# Altium project DC_Main_sample_A.PrjPcb (part 1 of 2)
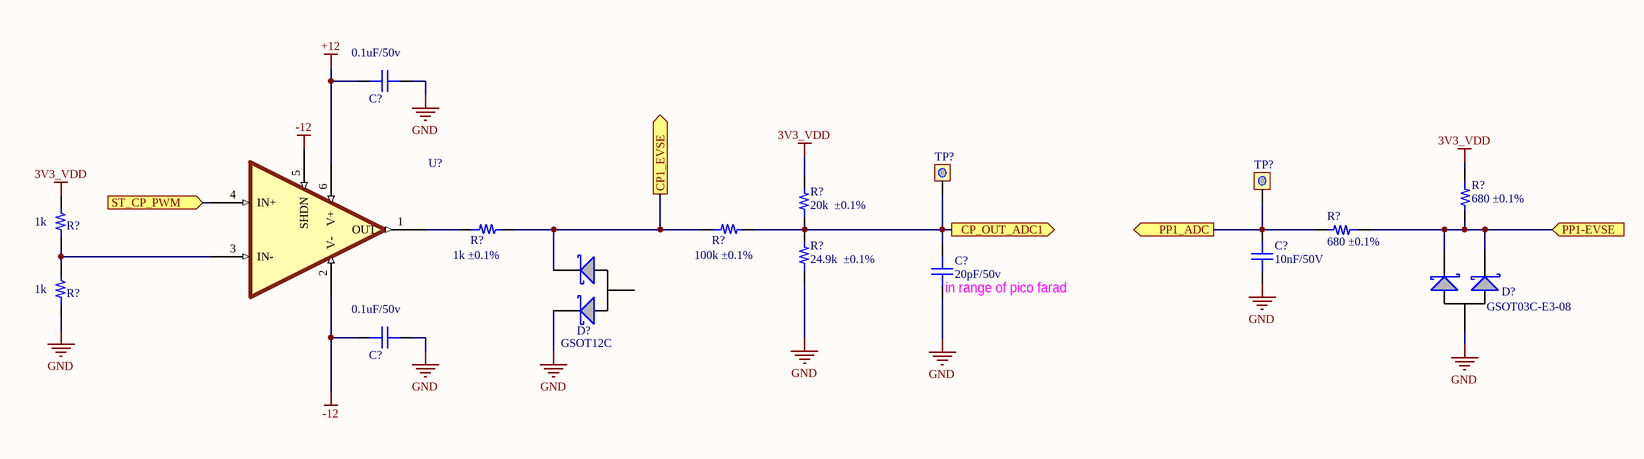
[diagram p0: Control_Pilot.SchDoc]
8 sheets, 353 parts. Net scope: flat (ports and power ports of the same name join across sheets).
Sheets:
  Control_Pilot.SchDoc
  PLC.SchDoc
  Analog_Interface.SchDoc
  Memory.SchDoc
  Power_Supply.SchDoc
  Screen_Interface.SchDoc
  CAN_Interface.SchDoc
  STM32.SchDoc

## Sheet Control_Pilot.SchDoc
size B; SheetNumber: 1; SheetTotal: 8

### Parts
(Parts that share a designator on the sheet are numbered #1, #2 ... from top to bottom, then left to right.)
C?#1  value 0.1uF/50v  [C1206]  (hidden comment: Capacitor)
C?#2  value 10nF/50V  [C1206]  (hidden comment: Capacitor)
C?#3  value 20pF/50v  [C1206]  (hidden comment: Capacitor)
C?#4  value 0.1uF/50v  [C1206]  (hidden comment: Capacitor)
D?#1  value GSOT12C  (hidden comment: GSOT12C-E3-08)
D?#2  GSOT03C-E3-08
R?#1  value 680 ±0.1%  [R0603]  (hidden comment: Resistor)
R?#2  value 1k ±0.1%  [R0603]  (hidden comment: Resistor)
R?#3  value 100k ±0.1%  [R0603]  (hidden comment: Resistor)
R?#4  value 20k  ±0.1%  [R0603]  (hidden comment: Resistor)
R?#5  value 680 ±0.1%  [R0603]  (hidden comment: Resistor)
R?#6  value 1k  [R0402]  (hidden comment: Resistor)
R?#7  value 24.9k  ±0.1%  [R0603]  (hidden comment: Resistor)
R?#8  value 1k  [R0402]  (hidden comment: Resistor)
TP?#1  TEST-PIN  [Test_Pin]  (value not drawn)  (no BOM)
TP?#2  TEST-PIN  [Test_Pin]  (value not drawn)  (no BOM)
U?#1  Comparator  [SOT-23-6]  (value not drawn)

### Ports
CP1_EVSE (out), CP_OUT_ADC1 (out), PP1-EVSE (in), PP1_ADC (out), ST_CP_PWM (in)

### Nets
3V3_VDD: R?#1.1 R?#4.1 R?#6.1  [project net 3V3_CG]
+12: C?#1.1 U?#1.6(V+)
-12: C?#4.1 U?#1.2(V-) U?#1.5(SHDN)
GND: C?#1.1 C?#2.1 C?#3.1 C?#4.1 D?#1.1(K1) D?#2.3(A) R?#7.1 R?#8.1
NetC?#2_1: C?#2.1 R?#5.1 TP?#2.1(TP) ; port PP1_ADC
NetC?#3_1: C?#3.1 R?#3.1 R?#4.1 R?#7.1 TP?#1.1(TP) ; port CP_OUT_ADC1
NetD?#1_2: D?#1.2(K2) R?#2.1 R?#3.1 ; port CP1_EVSE
NetD?#2_1: D?#2.1(K1) D?#2.2(K2) R?#1.1 R?#5.1 ; port PP1-EVSE
NetR?#2_1: R?#2.1 U?#1.1(OUT)
NetR?#6_1: R?#6.1 R?#8.1 U?#1.3(IN-)
NetU?#1_4: U?#1.4(IN+) ; port ST_CP_PWM

Not connected (* = marked no-connect by the designer): D?#1 3(A)

### Notes on the sheet
- (near C?#3) in range of pico farad

### Library data of the parts
C?#1-C?#4 = CAP_SMT: ComponentLink1Description: New link
D?#1 D?#2 = GSOT03C-E3-08: 12.3V Clamp 30A (8/20µs) Ipp Tvs Diode Surface Mount SOT-23-3; ComponentLink1Description: New link
  D?#2: value: GSOT03C-E3-08
R?#1-R?#8 = RES_SMT: ComponentLink1Description: New link; ComponentLink1URL: *
U?#1 = TLV1805QDBVRQ1: Automotive high volt comparator with push-pull output and shutdown 6-SOT-23 -40 to 125; ComponentLink1Description: New link; ComponentLink1URL: *
TP?#1 TP?#2 = TEST-PIN: ComponentLink1Description: Link

## Sheet PLC.SchDoc
size C; SheetNumber: 2; SheetTotal: 8
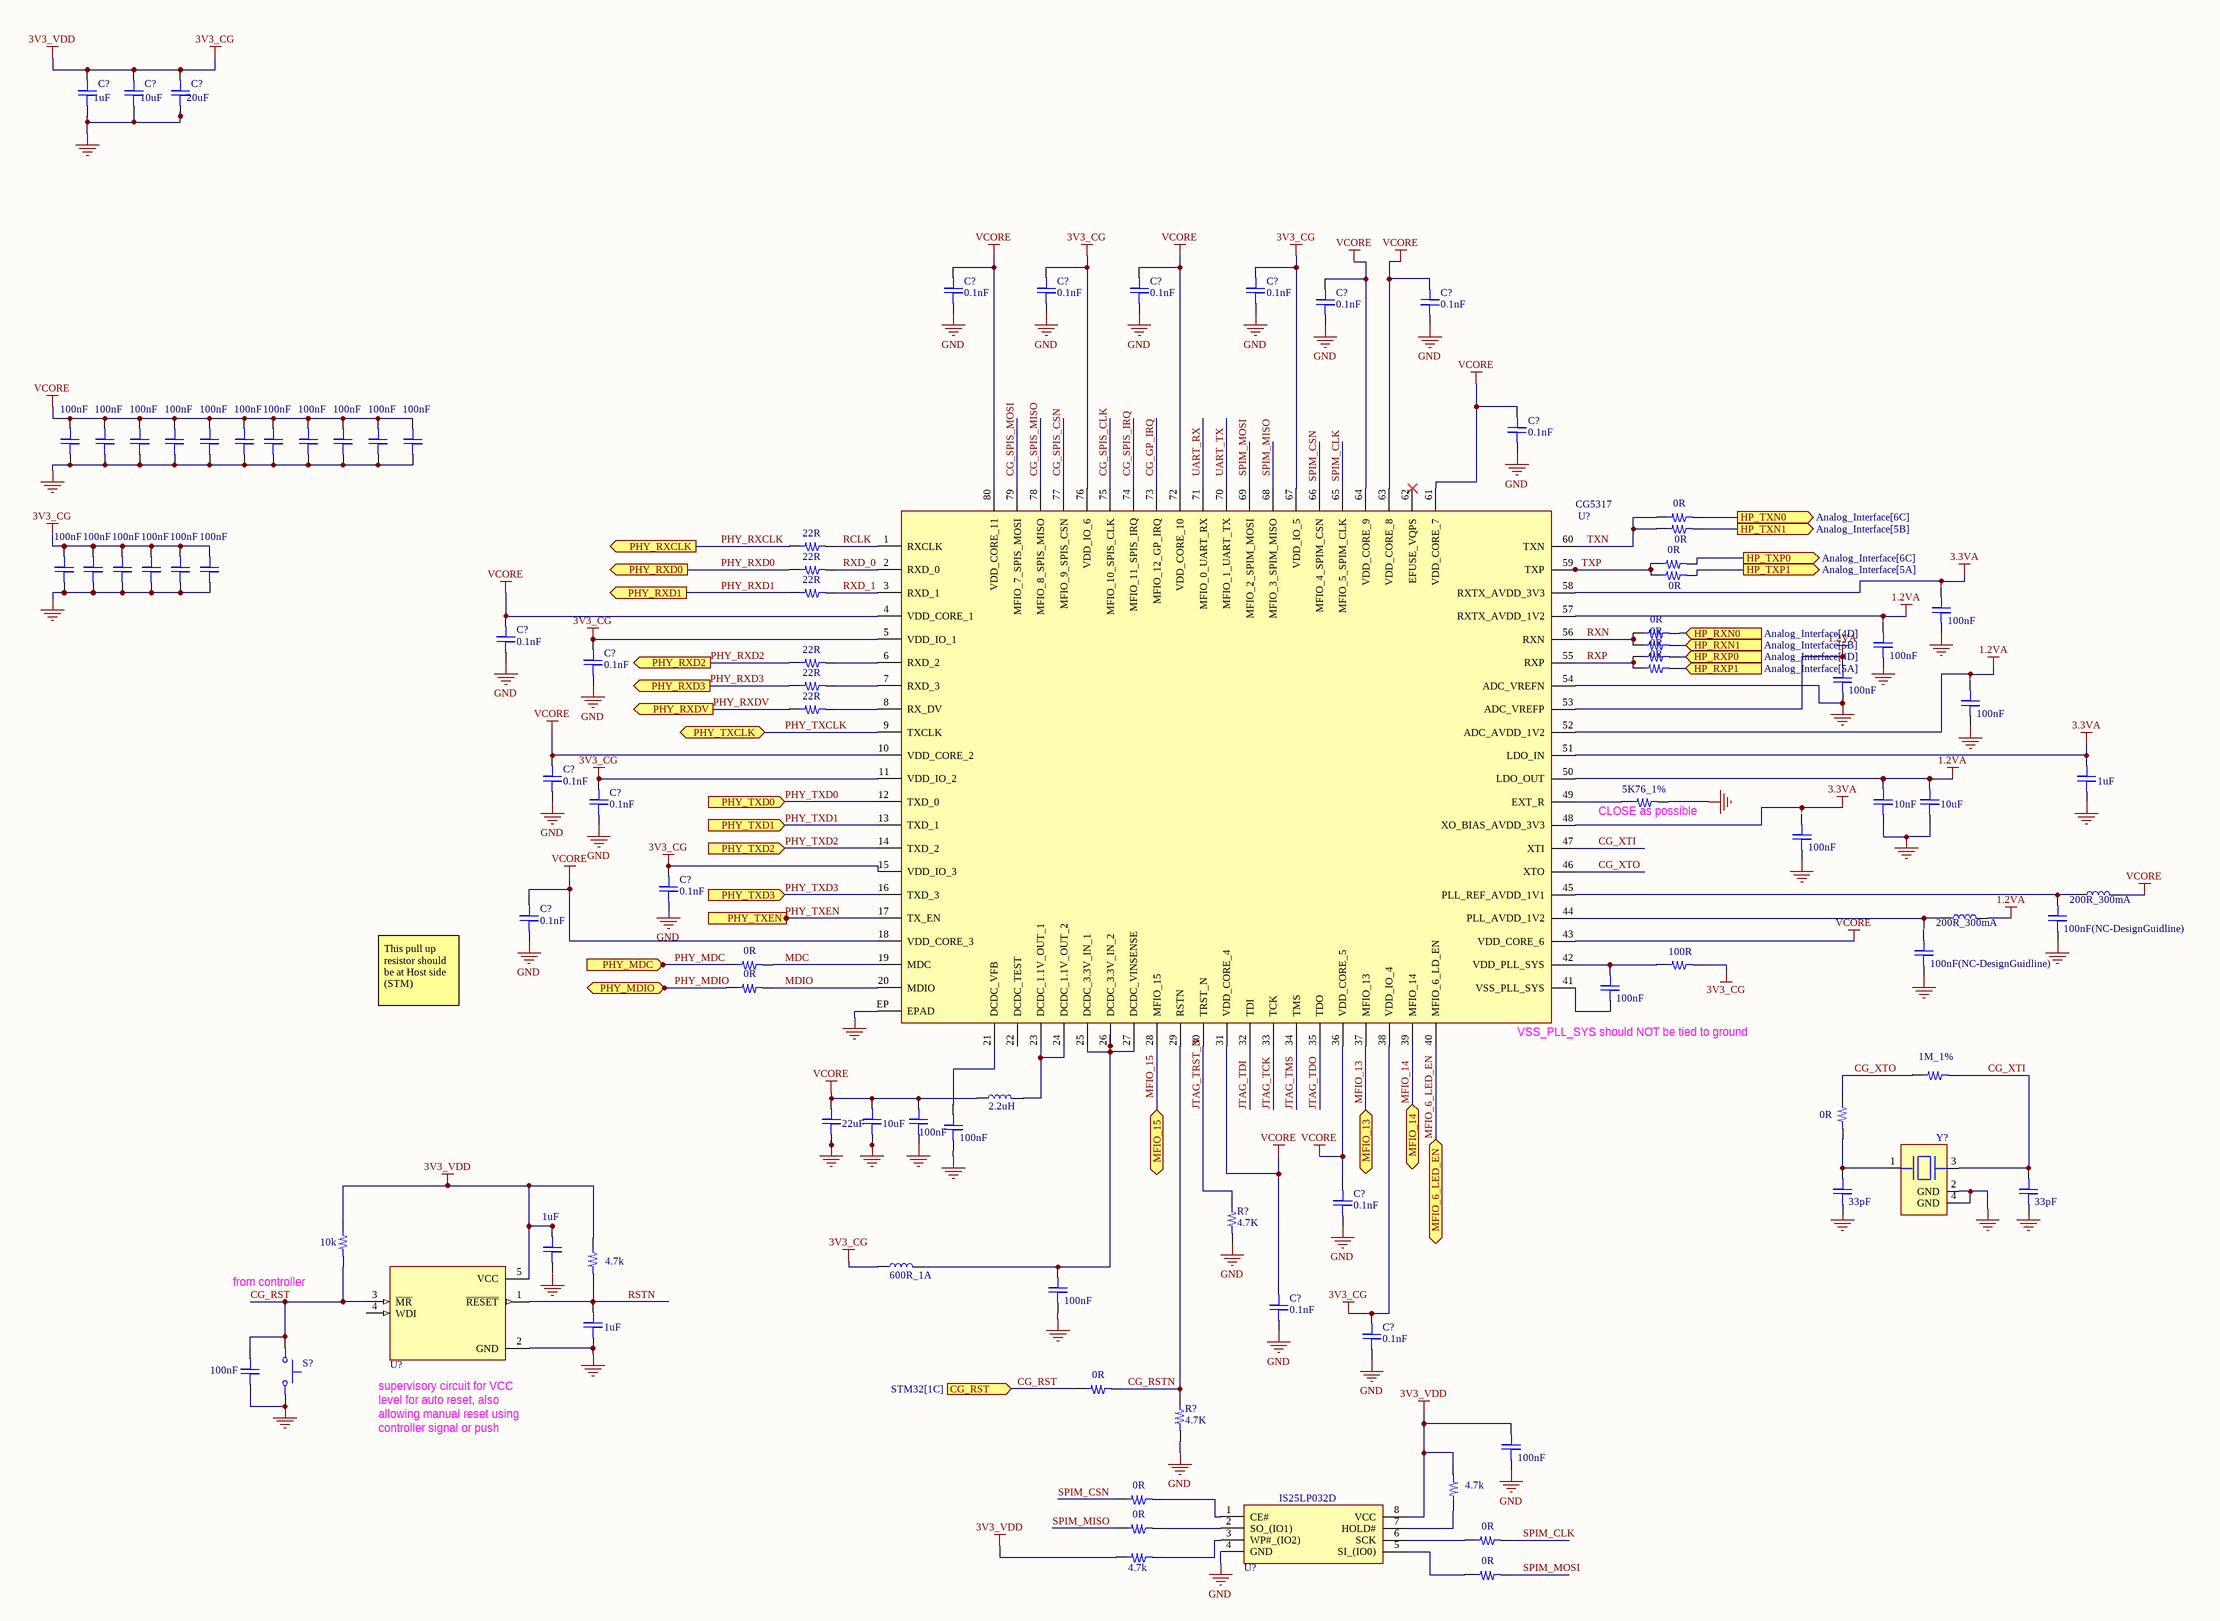
[diagram p1: PLC.SchDoc]

### Parts
(Parts that share a designator on the sheet are numbered #1, #2 ... from top to bottom, then left to right.)
C?#5  value 1uF  [C0402]
C?#6  value 10uF  [C0402]
C?#7  value 20uF  [C0402]
C?#8  value 0.1nF  [C0402]  (hidden comment: Capacitor)
C?#9  value 0.1nF  [C0402]  (hidden comment: Capacitor)
C?#10  value 0.1nF  [C0402]  (hidden comment: Capacitor)
C?#11  value 0.1nF  [C0402]  (hidden comment: Capacitor)
C?#12  value 0.1nF  [C0402]  (hidden comment: Capacitor)
C?#13  value 0.1nF  [C0402]  (hidden comment: Capacitor)
C?#14  value 0.1nF  [C0402]  (hidden comment: Capacitor)
C?#15  value 100nF  [C0402]  (hidden comment: Capacitor)
C?#16  value 100nF  [C0402]  (hidden comment: Capacitor)
C?#17  value 100nF  [C0402]  (hidden comment: Capacitor)
C?#18  value 100nF  [C0402]  (hidden comment: Capacitor)
C?#19  value 100nF  [C0402]  (hidden comment: Capacitor)
C?#20  value 100nF  [C0402]  (hidden comment: Capacitor)
C?#21  value 100nF  [C0402]  (hidden comment: Capacitor)
C?#22  value 100nF  [C0402]  (hidden comment: Capacitor)
C?#23  value 100nF  [C0402]  (hidden comment: Capacitor)
C?#24  value 100nF  [C0402]  (hidden comment: Capacitor)
C?#25  value 100nF  [C0402]  (hidden comment: Capacitor)
C?#26  value 100nF  [C0402]  (hidden comment: Capacitor)
C?#27  value 100nF  [C0402]  (hidden comment: Capacitor)
C?#28  value 100nF  [C0402]  (hidden comment: Capacitor)
C?#29  value 100nF  [C0402]  (hidden comment: Capacitor)
C?#30  value 100nF  [C0402]  (hidden comment: Capacitor)
C?#31  value 100nF  [C0402]  (hidden comment: Capacitor)
C?#32  value 100nF  [C0402]  (hidden comment: Capacitor)
C?#33  value 100nF  [C0402]  (hidden comment: Capacitor)
C?#34  value 0.1nF  [C0402]  (hidden comment: Capacitor)
C?#35  value 100nF  [C0402]  (hidden comment: Capacitor)
C?#36  value 0.1nF  [C0402]  (hidden comment: Capacitor)
C?#37  value 100nF  [C0402]  (hidden comment: Capacitor)
C?#38  value 1uF  [C0402]  (hidden comment: Capacitor)
C?#39  value 0.1nF  [C0402]  (hidden comment: Capacitor)
C?#40  value 10nF  [C0402]  (hidden comment: Capacitor)
C?#41  value 10uF  [C0402]  (hidden comment: Capacitor)
C?#42  value 0.1nF  [C0402]  (hidden comment: Capacitor)
C?#43  value 100nF  [C0402]  (hidden comment: Capacitor)
C?#44  value 0.1nF  [C0402]  (hidden comment: Capacitor)
C?#45  value 100nF(NC-DesignGuidline)  [C0402]  (hidden comment: Capacitor)
C?#46  value 0.1nF  [C0402]  (hidden comment: Capacitor)
C?#47  value 100nF(NC-DesignGuidline)  [C0402]  (hidden comment: Capacitor)
C?#48  value 100nF  [C0402]  (hidden comment: Capacitor)
C?#49  value 22uF  [C0402]  (hidden comment: Capacitor)
C?#50  value 10uF  [C0402]  (hidden comment: Capacitor)
C?#51  value 100nF  [C0402]  (hidden comment: Capacitor)
C?#52  value 100nF  [C0402]  (hidden comment: Capacitor)
C?#53  value 33pF  [C0402]  (hidden comment: Capacitor)
C?#54  value 33pF  [C0402]  (hidden comment: Capacitor)
C?#55  value 0.1nF  [C0402]  (hidden comment: Capacitor)
C?#56  value 1uF  [C0402]  (hidden comment: Capacitor)
C?#57  value 0.1nF  [C0402]  (hidden comment: Capacitor)
C?#58  value 100nF  [C0402]  (hidden comment: Capacitor)
C?#59  value 0.1nF  [C0402]  (hidden comment: Capacitor)
C?#60  value 1uF  [C0402]  (hidden comment: Capacitor)
C?#61  value 100nF  [C0402]  (hidden comment: Capacitor)
C?#62  value 100nF  [C0402]  (hidden comment: Capacitor)
L?#1  value 200R_300mA  [L_0805]  (hidden comment: Inductor_SMT)
L?#2  value 200R_300mA  [L_0805]  (hidden comment: Inductor_SMT)
L?#3  value 2.2uH  [L_0805]  (hidden comment: Inductor_SMT)
L?#4  value 600R_1A  [L_0805]  (hidden comment: Inductor_SMT)
R?#9  value 0R  [R0402]  (hidden comment: Resistor)
R?#10  value 0R  [R0402]  (hidden comment: Resistor)
R?#11  value 22R  [R0402]  (hidden comment: Resistor)
R?#12  value 0R  [R0402]  (hidden comment: Resistor)
R?#13  value 22R  [R0402]  (hidden comment: Resistor)
R?#14  value 0R  [R0402]  (hidden comment: Resistor)
R?#15  value 22R  [R0402]  (hidden comment: Resistor)
R?#16  value 0R  [R0402]  (hidden comment: Resistor)
R?#17  value 0R  [R0402]  (hidden comment: Resistor)
R?#18  value 0R  [R0402]  (hidden comment: Resistor)
R?#19  value 22R  [R0402]  (hidden comment: Resistor)
R?#20  value 0R  [R0402]  (hidden comment: Resistor)
R?#21  value 22R  [R0402]  (hidden comment: Resistor)
R?#22  value 22R  [R0402]  (hidden comment: Resistor)
R?#23  value 5K76_1%  [R0402]  (hidden comment: Resistor)
R?#24  value 0R  [R0402]  (hidden comment: Resistor)
R?#25  value 100R  [R0402]  (hidden comment: Resistor)
R?#26  value 0R  [R0402]  (hidden comment: Resistor)
R?#27  value 1M_1%  [R0402]  (hidden comment: Resistor)
R?#28  value 0R  [R0402]  (hidden comment: Resistor)
R?#29  value 4.7K  [R0402]  (hidden comment: Resistor)
R?#30  value 10k  [R0402]  (hidden comment: Resistor)
R?#31  value 4.7k  [R0402]  (hidden comment: Resistor)
R?#32  value 0R  [R0402]  (hidden comment: Resistor)
R?#33  value 4.7K  [R0402]  (hidden comment: Resistor)
R?#34  value 4.7k  [R0402]  (hidden comment: Resistor)
R?#35  value 0R  [R0402]  (hidden comment: Resistor)
R?#36  value 0R  [R0402]  (hidden comment: Resistor)
R?#37  value 0R  [R0402]  (hidden comment: Resistor)
R?#38  value 4.7k  [R0402]  (hidden comment: Resistor)
R?#39  value 0R  [R0402]  (hidden comment: Resistor)
S?#1  Push Button 4 pin  [Push_Button(6x6mm)]  (value not drawn)
U?#2  value CG5317  [EP-LQFP80]  (hidden comment: HomePlug Green PHY Transceiver)
U?#3  Supervisory Circuits  [SOT-23-5]  (value not drawn)
U?#4  Flash Memory  [SOIC-8]  (value not drawn)
Y?#1  Crystal  [FL2500316Z]  (value not drawn)

### Ports
CG_RST (in, see STM32[1C]), HP_RXN0 (in, see Analog_Interface[4D]), HP_RXN1 (in, see Analog_Interface[5B]), HP_RXP0 (in, see Analog_Interface[4D]), HP_RXP1 (in, see Analog_Interface[5A]), HP_TXN0 (out, see Analog_Interface[6C]), HP_TXN1 (out, see Analog_Interface[5B]), HP_TXP0 (out, see Analog_Interface[6C]), HP_TXP1 (out, see Analog_Interface[5A]), MFIO_6_LED_EN (bidir), MFIO_13 (bidir), MFIO_14 (bidir), MFIO_15 (bidir), PHY_MDC (in), PHY_MDIO (bidir), PHY_RXCLK (out), PHY_RXD0 (out), PHY_RXD1 (out), PHY_RXD2 (out), PHY_RXD3 (out), PHY_RXDV (out), PHY_TXCLK (bidir), PHY_TXD0 (in), PHY_TXD1 (in), PHY_TXD2 (in), PHY_TXD3 (in), PHY_TXEN (in)

### Nets
1.2VA: C?#35.1 C?#40.1 C?#41.1 L?#2.2 U?#2.50(LDO_OUT) U?#2.52(ADC_AVDD_1V2) U?#2.53(ADC_VREFP) U?#2.57(RXTX_AVDD_1V2)
3.3VA: C?#38.1 U?#2.48(XO_BIAS_AVDD_3V3) U?#2.51(LDO_IN) U?#2.58(RXTX_AVDD_3V3)
3V3_CG: C?#5.1 C?#6.1 C?#7.1 C?#9.1 C?#11.1 C?#27.1 C?#28.1 C?#29.1 C?#30.1 C?#31.1 C?#32.1 C?#36.1 C?#42.1 C?#44.1 C?#56.1 C?#59.1 C?#62.1 L?#4.1 R?#25.1 R?#30.1 R?#31.1 R?#34.1 R?#38.1 U?#2.5(VDD_IO_1) U?#2.11(VDD_IO_2) U?#2.15(VDD_IO_3) U?#2.38(VDD_IO_4) U?#2.67(VDD_IO_5) U?#2.76(VDD_IO_6) U?#3.5(VCC) U?#4.8(VCC)  [also labelled 3V3_VDD]
GND: C?#5.1 C?#6.1 C?#7.1 C?#8.1 C?#9.1 C?#10.1 C?#11.1 C?#12.1 C?#13.1 C?#14.1 C?#15.1 C?#16.1 C?#17.1 C?#18.1 C?#19.1 C?#20.1 C?#21.1 C?#22.1 C?#23.1 C?#24.1 C?#25.1 C?#26.1 C?#27.1 C?#28.1 C?#29.1 C?#30.1 C?#31.1 C?#32.1 C?#33.1 C?#34.1 C?#35.1 C?#36.1 C?#37.1 C?#38.1 C?#39.1 C?#40.1 C?#41.1 C?#42.1 C?#43.1 C?#44.1 C?#45.1 C?#46.1 C?#47.1 C?#49.1 C?#50.1 C?#51.1 C?#52.1 C?#55.1 C?#57.1 C?#58.1 C?#59.1 C?#60.1 C?#61.1 C?#62.1 R?#23.1 R?#29.1 R?#33.1 S?#1.3 S?#1.4 U?#2.54(ADC_VREFN) U?#2.EP(EPAD) U?#3.2(GND) U?#4.4(GND) Y?#1.2(GND) Y?#1.4(GND)
VCORE: C?#8.1 C?#10.1 C?#12.1 C?#13.1 C?#14.1 C?#15.1 C?#16.1 C?#17.1 C?#18.1 C?#19.1 C?#20.1 C?#21.1 C?#22.1 C?#23.1 C?#24.1 C?#25.1 C?#34.1 C?#39.1 C?#46.1 C?#49.1 C?#50.1 C?#51.1 C?#55.1 C?#57.1 L?#1.2 L?#3.1 U?#2.4(VDD_CORE_1) U?#2.10(VDD_CORE_2) U?#2.18(VDD_CORE_3) U?#2.31(VDD_CORE_4) U?#2.36(VDD_CORE_5) U?#2.43(VDD_CORE_6) U?#2.61(VDD_CORE_7) U?#2.63(VDD_CORE_8) U?#2.64(VDD_CORE_9) U?#2.72(VDD_CORE_10) U?#2.80(VDD_CORE_11)
CG_GP_IRQ: U?#2.73(MFIO_12_GP_IRQ)
CG_RST: C?#61.1 R?#30.1 R?#32.1 S?#1.1 S?#1.2 U?#3.3(~{MR}) ; port CG_RST
CG_RSTN: R?#32.1 R?#33.1 U?#2.29(RSTN)
CG_SPIS_CLK: U?#2.75(MFIO_10_SPIS_CLK)
CG_SPIS_CSN: U?#2.77(MFIO_9_SPIS_CSN)
CG_SPIS_IRQ: U?#2.74(MFIO_11_SPIS_IRQ)
CG_SPIS_MISO: U?#2.78(MFIO_8_SPIS_MISO)
CG_SPIS_MOSI: U?#2.79(MFIO_7_SPIS_MOSI)
CG_XTI: C?#54.1 R?#27.1 U?#2.47(XTI) Y?#1.3
CG_XTO: R?#27.1 R?#28.1 U?#2.46(XTO)
JTAG_TCK: U?#2.33(TCK)
JTAG_TDI: U?#2.32(TDI)
JTAG_TDO: U?#2.35(TDO)
JTAG_TMS: U?#2.34(TMS)
JTAG_TRST_N: R?#29.1 U?#2.30(TRST_N)
MDC: R?#24.1 U?#2.19(MDC)
MDIO: R?#26.1 U?#2.20(MDIO)
MFIO_6_LED_EN: U?#2.40(MFIO_6_LD_EN) ; port MFIO_6_LED_EN
MFIO_13: U?#2.37(MFIO_13) ; port MFIO_13
MFIO_14: U?#2.39(MFIO_14) ; port MFIO_14
MFIO_15: U?#2.28(MFIO_15) ; port MFIO_15
PHY_MDC: R?#24.1 ; port PHY_MDC
PHY_MDIO: R?#26.1 ; port PHY_MDIO
PHY_RXCLK: R?#11.1 ; port PHY_RXCLK
PHY_RXD0: R?#13.1 ; port PHY_RXD0
PHY_RXD1: R?#15.1 ; port PHY_RXD1
PHY_RXD2: R?#19.1 ; port PHY_RXD2
PHY_RXD3: R?#21.1 ; port PHY_RXD3
PHY_RXDV: R?#22.1 ; port PHY_RXDV
PHY_TXCLK: U?#2.9(TXCLK) ; port PHY_TXCLK
PHY_TXD0: U?#2.12(TXD_0) ; port PHY_TXD0
PHY_TXD1: U?#2.13(TXD_1) ; port PHY_TXD1
PHY_TXD2: U?#2.14(TXD_2) ; port PHY_TXD2
PHY_TXD3: U?#2.16(TXD_3) ; port PHY_TXD3
PHY_TXEN: U?#2.17(TX_EN) ; port PHY_TXEN
RCLK: R?#11.1 U?#2.1(RXCLK)
RSTN: C?#60.1 R?#31.1 U?#3.1(~{RESET})
RXD_0: R?#13.1 U?#2.2(RXD_0)
RXD_1: R?#15.1 U?#2.3(RXD_1)
RXN: R?#16.1 R?#17.1 U?#2.56(RXN)
RXP: R?#18.1 R?#20.1 U?#2.55(RXP)
SPIM_CLK: R?#37.1 U?#2.65(MFIO_5_SPIM_CLK)
SPIM_CSN: R?#35.1 U?#2.66(MFIO_4_SPIM_CSN)
SPIM_MISO: R?#36.1 U?#2.68(MFIO_3_SPIM_MISO)
SPIM_MOSI: R?#39.1 U?#2.69(MFIO_2_SPIM_MOSI)
TXN: R?#9.1 R?#10.1 U?#2.60(TXN)
TXP: R?#12.1 R?#14.1 U?#2.59(TXP)
UART_RX: U?#2.71(MFIO_0_UART_RX)
UART_TX: U?#2.70(MFIO_1_UART_TX)
Net?#1_1: R?#12.1 ; port HP_TXP0
Net?#2_2: R?#9.1 ; port HP_TXN0
NetC?#45_1: C?#45.1 L?#1.1 U?#2.45(PLL_REF_AVDD_1V1)
NetC?#48_1: C?#48.1 R?#25.1 U?#2.42(VDD_PLL_SYS)
NetC?#48_1: C?#48.1 U?#2.41(VSS_PLL_SYS)  [a separate net that carries the same name]
NetC?#52_1: C?#52.1 U?#2.21(DCDC_VFB)
NetC?#53_1: C?#53.1 R?#28.1 Y?#1.1
NetC?#58_1: C?#58.1 L?#4.2 U?#2.25(DCDC_3.3V_IN_1) U?#2.26(DCDC_3.3V_IN_2) U?#2.27(DCDC_VINSENSE)
NetC?#66_1: R?#14.1 ; port HP_TXP1
NetC?#70_1: R?#10.1 ; port HP_TXN1
NetL?#2_1: L?#2.1 U?#2.44(PLL_AVDD_1V2)
NetL?#3_2: L?#3.2 U?#2.23(DCDC_1.1V_OUT_1) U?#2.24(DCDC_1.1V_OUT_2)
NetR?#16_1: R?#16.1 ; port HP_RXN0
NetR?#17_1: R?#17.1 ; port HP_RXN1
NetR?#18_1: R?#18.1 ; port HP_RXP0
NetR?#19_1: R?#19.1 U?#2.6(RXD_2)
NetR?#20_1: R?#20.1 ; port HP_RXP1
NetR?#21_1: R?#21.1 U?#2.7(RXD_3)
NetR?#22_1: R?#22.1 U?#2.8(RX_DV)
NetR?#23_1: R?#23.1 U?#2.49(EXT_R)
NetR?#34_1: R?#34.1 U?#4.7(HOLD#)
NetR?#35_1: R?#35.1 U?#4.1(CE#)
NetR?#36_1: R?#36.1 U?#4.2(SO_(IO1))
NetR?#37_1: R?#37.1 U?#4.6(SCK)
NetR?#38_1: R?#38.1 U?#4.3(WP#_(IO2))
NetR?#39_1: R?#39.1 U?#4.5(SI_(IO0))

Not connected (* = marked no-connect by the designer): U?#2 22(DCDC_TEST) 62(EFUSE_VQPS)*; U?#3 4(WDI)

### Notes on the sheet
- (near R?#23) CLOSE as possible
- This pull up resistor should be at Host side (STM)
- (near U?#2) VSS_PLL_SYS should NOT be tied to ground
- (near R?#30) from controller
- (near U?#3) supervisory circuit for VCC level for auto reset, also allowing manual reset using controller signal or push buttonText
- Labels drawn without touching a wire or pin: GND

### Library data of the parts
C?#5-C?#7 C?#15-C?#33 C?#35 C?#37 C?#38 C?#40 C?#41 C?#43 C?#45 C?#47-C?#54 C?#56 C?#58 C?#60-C?#62 = CAP_SMT: ComponentLink1Description: New link
C?#8-C?#14 C?#34 C?#36 C?#39 C?#42 C?#44 C?#46 C?#55 C?#57 C?#59 = C_0.1uf: 50V 100nF X7R ±10% 0402 Multilayer Ceramic Capacitors MLCC - SMD/SMT ROHS; Mfr: YAGEO; Mfr_prt_no: CC0402KRX7R9BB104; pkg: 0402; ComponentLink1Description: New link; ComponentLink1URL: https://www.lcsc.com/product-detail/Multilayer-Ceramic-Capacitors-MLCC-SMD-SMT_YAGEO-CC0402KRX7R9BB104_C131394.html; supplier: LCSC; supplier_prt_no: C131394
R?#9-R?#28 R?#30-R?#32 R?#34-R?#39 = RES_SMT: ComponentLink1Description: New link; ComponentLink1URL: *
R?#29 R?#33 = R_4.7K: 62.5mW Thick Film Resistors 50V ±100ppm/℃ ±5% 4.7kΩ 0402 Chip Resistor - Surface Mount ROHS; Mfr: YAGEO; Mfr_prt_no: RC0402JR-074K7L; pkg: 0402; ComponentLink1Description: New link; ComponentLink1URL: *; supplier: LCSC; supplier_prt_no: C105870
S?#1 = Push_Button: Push Button SMD(6x6mm) 4 pin; ComponentLink1Description: New link
U?#2 = CG5317: HomePlug Green PHY Transceiver,EP-LQFP80; ComponentLink1Description: New link
U?#3 = MAX823: Supervisory Circuits 5-Pin Microprocessor Supervisory Circuit; ComponentLink1Description: New link
U?#4 = IS25LP032D: FLASH - NOR Memory IC 32Mb (4M x 8) SPI - Quad I/O, QPI, DTR 133 MHz 8-SOIC; ComponentLink1Description: New link; Mfr_prt_no: IS25LP032D
Y?#1 = FL2500316Z: 25 MHz ±20ppm Crystal 20pF 30 Ohms 4-SMD, No Lead; ComponentLink1Description: New link
L?#1-L?#4 = Inductor_SMT: ComponentLink1Description: New link

## Sheet Analog_Interface.SchDoc
size C; SheetNumber: 3; SheetTotal: 8
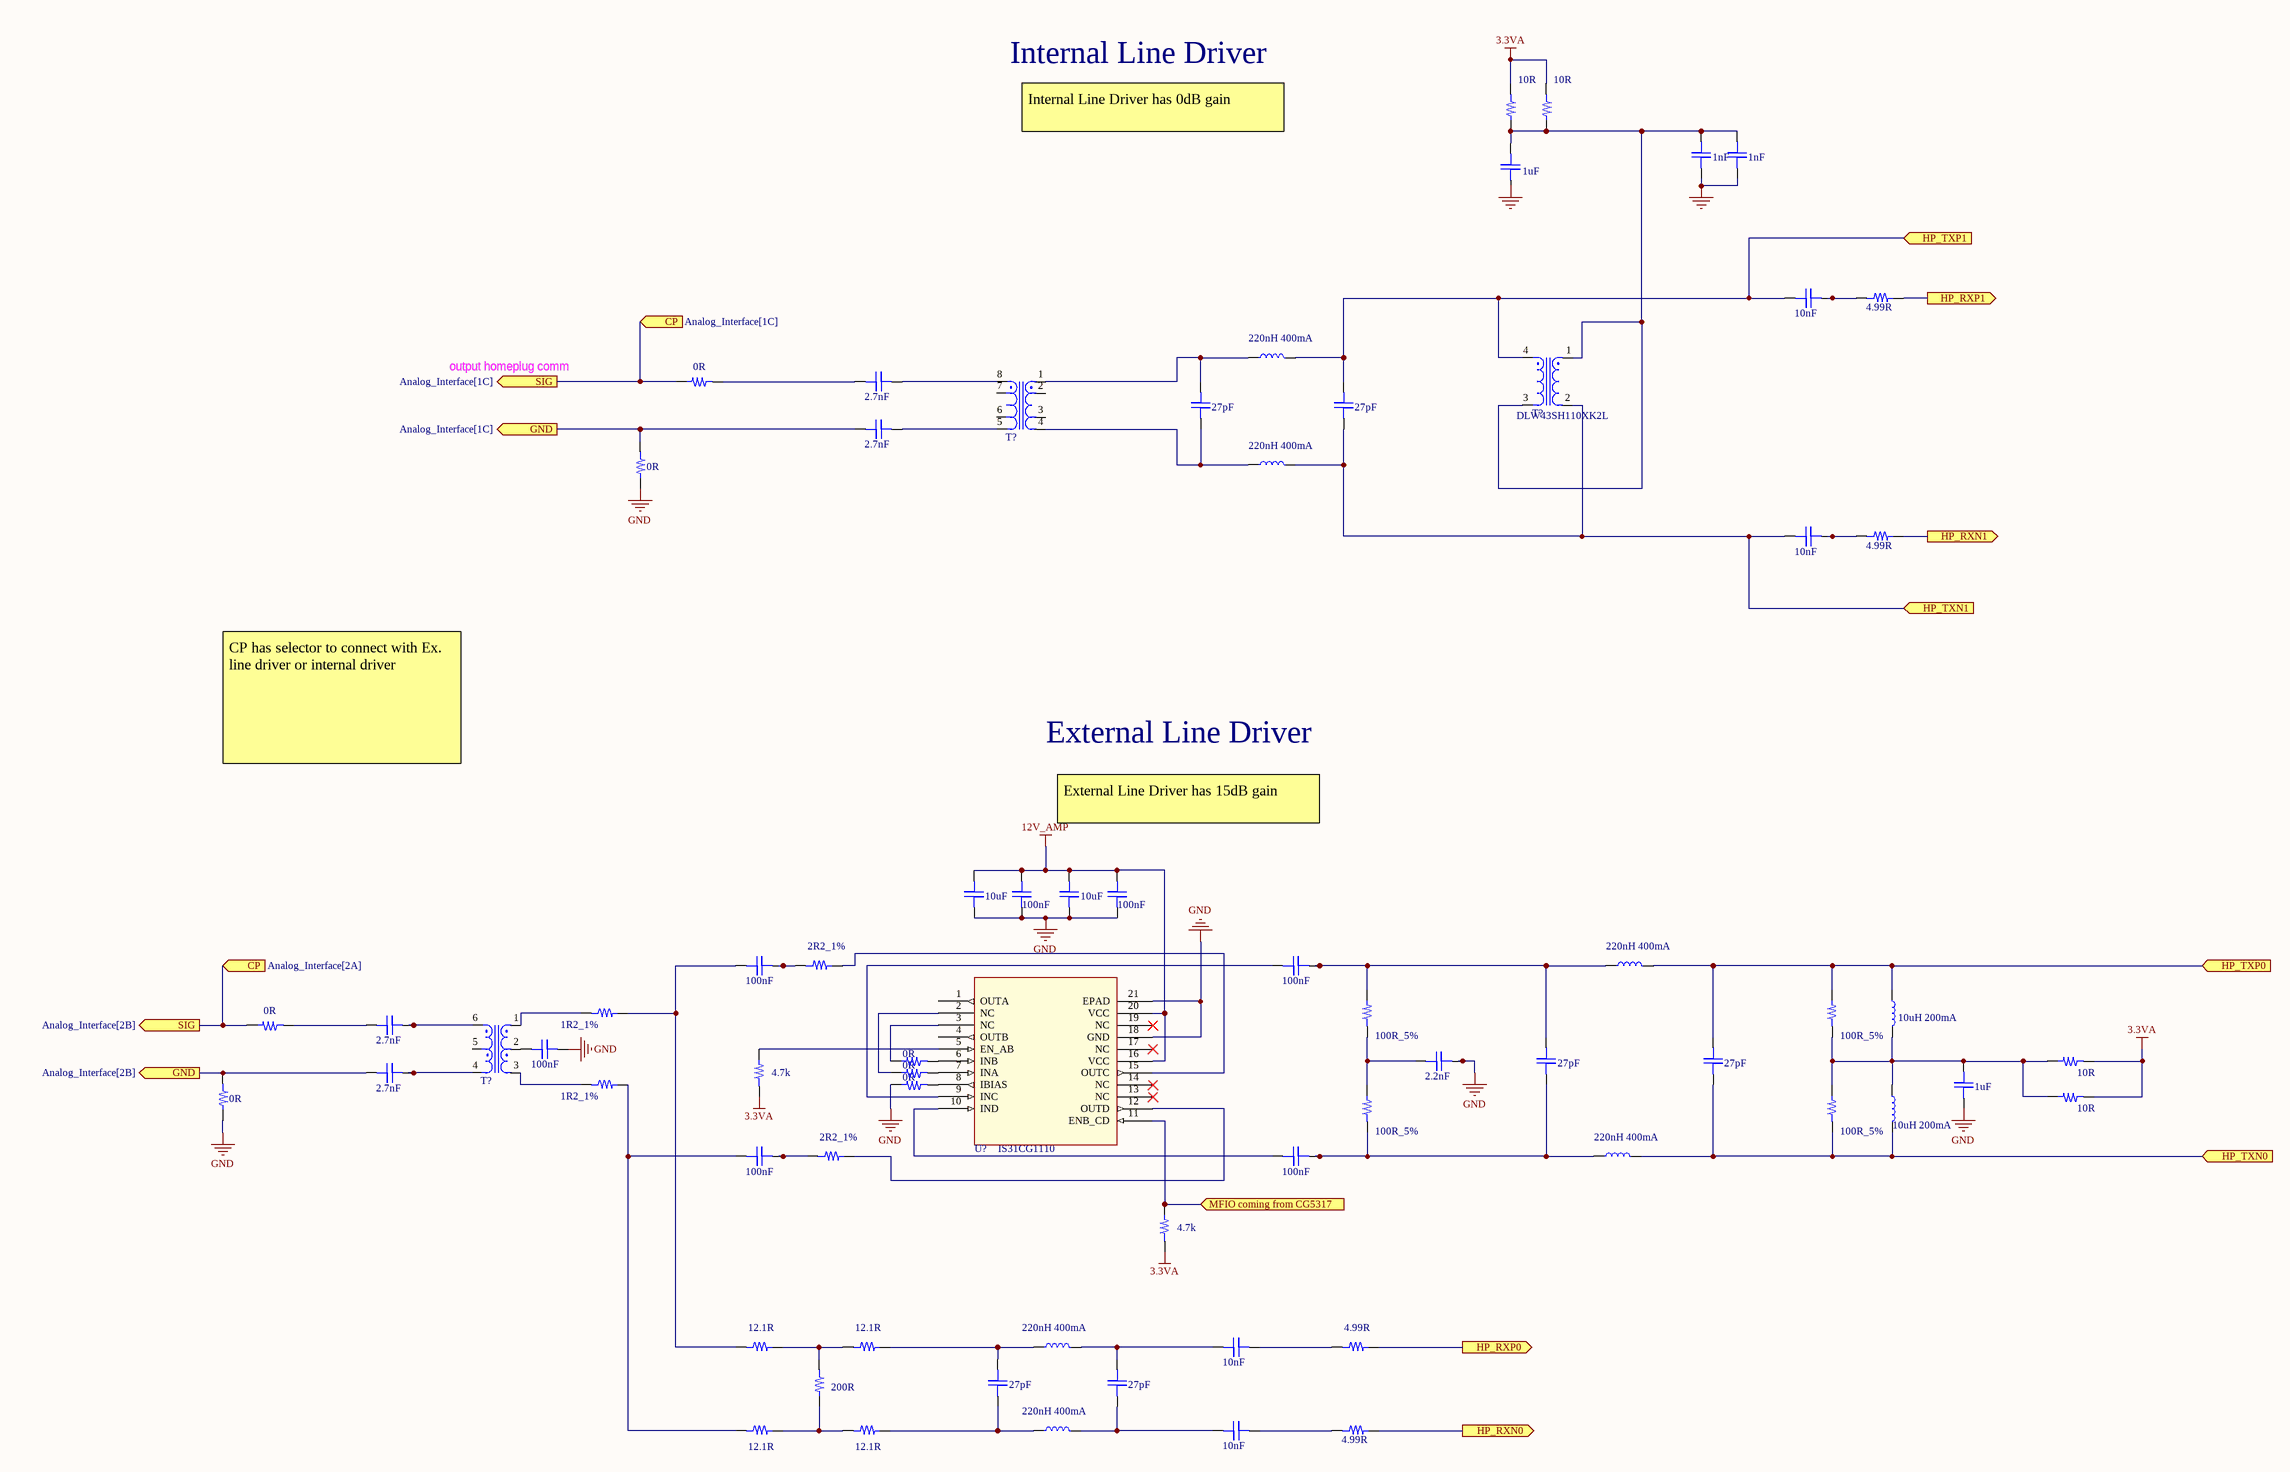
[diagram p2: Analog_Interface.SchDoc]

### Parts
(Parts that share a designator on the sheet are numbered #1, #2 ... from top to bottom, then left to right.)
?#1  10uH 200mA  [L_0805]
?#2  10uH 200mA  [L_0805]
C?#63  1nF  [C0402]
C?#64  1nF  [C0402]
C?#65  1uF  [C0402]
C?#66  10nF  [C0402]
C?#67  2.7nF  [C0402]
C?#68  2.7nF  [C0402]
C?#69  27pF  [C0402]
C?#70  27pF  [C0402]
C?#71  10nF  [C0402]
C?#72  value 10uF  [C0402]  (hidden comment: Capacitor)
C?#73  value 100nF  [C0402]  (hidden comment: Capacitor)
C?#74  value 10uF  [C0402]  (hidden comment: Capacitor)
C?#75  value 100nF  [C0402]  (hidden comment: Capacitor)
C?#76  100nF  [C0402]
C?#77  100nF  [C0402]
C?#78  2.7nF  [C0402]
C?#79  value 100nF  [C0402]  (hidden comment: Capacitor)
C?#80  2.2nF  [C0402]
C?#81  1uF  [C0402]
C?#82  2.7nF  [C0402]
C?#83  27pF  [C0402]
C?#84  27pF  [C0402]
C?#85  100nF  [C0402]
C?#86  100nF  [C0402]
C?#87  10nF  [C0402]
C?#88  27pF  [C0402]
C?#89  27pF  [C0402]
C?#90  10nF  [C0402]
L?#5  220nH 400mA  [L_0805]
L?#6  220nH 400mA  [L_0805]
L?#7  220nH 400mA  [L_0805]
L?#8  220nH 400mA  [L_0805]
L?#9  220nH 400mA  [L_0805]
L?#10  220nH 400mA  [L_0805]
R?#40  10R  [R0402]
R?#41  10R  [R0402]
R?#42  4.99R  [R0402]
R?#43  value 0R  [R0402]  (hidden comment: Resistor)
R?#44  value 0R  [R0402]  (hidden comment: Resistor)
R?#45  4.99R  [R0402]
R?#46  2R2_1%  [R0402]
R?#47  1R2_1%  [R0402]
R?#48  value 0R  [R0402]  (hidden comment: Resistor)
R?#49  100R_5%  [R0402]
R?#50  100R_5%  [R0402]
R?#51  value 0R  [R0402]  (hidden comment: Resistor)
R?#52  10R  [R0402]
R?#53  value 0R  [R0402]  (hidden comment: Resistor)
R?#54  value 0R  [R0402]  (hidden comment: Resistor)
R?#55  1R2_1%  [R0402]
R?#56  value 0R  [R0402]  (hidden comment: Resistor)
R?#57  value 4.7k  [R0402]  (hidden comment: Resistor)
R?#58  10R  [R0402]
R?#59  100R_5%  [R0402]
R?#60  100R_5%  [R0402]
R?#61  2R2_1%  [R0402]
R?#62  value 4.7k  [R0402]  (hidden comment: Resistor)
R?#63  12.1R  [R0402]
R?#64  12.1R  [R0402]
R?#65  4.99R  [R0402]
R?#66  200R  [R0402]
R?#67  12.1R  [R0402]
R?#68  12.1R  [R0402]
R?#69  4.99R  [R0402]
T?#1  DLW43SH110XK2L
T?#2  Transformer  (value not drawn)
T?#3  Transformer  (value not drawn)
U?#5  value IS31CG1110  [QFLS2]  (hidden comment: ISSI Line Driver IC)

### Ports
CP (in, see Analog_Interface[1C]), CP (in, see Analog_Interface[2A]), GND (out, see Analog_Interface[1C]), GND (out, see Analog_Interface[2B]), HP_RXN0 (out, see PLC[5B]), HP_RXN1 (out, see PLC[5B]), HP_RXP0 (out, see PLC[5B]), HP_RXP1 (out, see PLC[5B]), HP_TXN0 (in, see PLC[5B]), HP_TXN1 (in, see PLC[5B]), HP_TXP0 (in, see PLC[5B]), HP_TXP1 (in, see PLC[5B]), MFIO coming from CG5317 (in), SIG (out, see Analog_Interface[1C]), SIG (out, see Analog_Interface[2B])

### Nets
3.3VA: R?#40.1 R?#41.1 R?#52.1 R?#57.1 R?#58.1 R?#62.1
12V_AMP: C?#72.1 C?#73.1 C?#74.1 C?#75.1 U?#5.16(VCC) U?#5.20(VCC)
GND: C?#63.1 C?#64.1 C?#72.1 C?#73.1 C?#74.1 C?#75.1 C?#79.1 C?#80.1 C?#81.1 R?#44.1 R?#53.1 R?#56.1 U?#5.18(GND) U?#5.21(EPAD)
Net?#1_1: ?#1.1 C?#84.1 L?#7.2 R?#50.1 ; port HP_TXP0
Net?#1_2: ?#1.2 ?#2.1 C?#81.1 R?#50.1 R?#52.1 R?#58.1 R?#60.1
Net?#2_2: ?#2.2 C?#84.1 L?#8.2 R?#60.1 ; port HP_TXN0
NetC?#63_1: C?#63.1 C?#64.1 C?#65.1 R?#40.1 R?#41.1 T?#1.1 T?#1.3
NetC?#66_1: C?#66.1 C?#70.1 L?#5.2 T?#1.4 ; port HP_TXP1
NetC?#66_1: C?#66.1 R?#42.1  [a separate net that carries the same name]
NetC?#67_1: C?#67.1 T?#2.8
NetC?#67_1: C?#67.1 R?#43.1  [a separate net that carries the same name]
NetC?#68_1: C?#68.1 T?#2.5
NetC?#68_1: C?#68.1 C?#82.1 R?#44.1 R?#53.1 ; port GND  [a separate net that carries the same name]
NetC?#69_1: C?#69.1 L?#5.1 T?#2.1
NetC?#69_1: C?#69.1 L?#6.1 T?#2.4  [a separate net that carries the same name]
NetC?#70_1: C?#70.1 C?#71.1 L?#6.2 T?#1.2 ; port HP_TXN1
NetC?#71_1: C?#71.1 R?#45.1
NetC?#76_1: C?#76.1 R?#47.1 R?#63.1
NetC?#76_1: C?#76.1 R?#46.1  [a separate net that carries the same name]
NetC?#77_1: C?#77.1 C?#83.1 L?#7.1 R?#49.1
NetC?#77_1: C?#77.1 U?#5.9(INC)  [a separate net that carries the same name]
NetC?#78_1: C?#78.1 T?#3.6
NetC?#78_1: C?#78.1 R?#48.1  [a separate net that carries the same name]
NetC?#79_1: C?#79.1 T?#3.2
NetC?#80_1: C?#80.1 R?#49.1 R?#59.1
NetC?#82_1: C?#82.1 T?#3.4
NetC?#83_1: C?#83.1 C?#86.1 L?#8.1 R?#59.1
NetC?#85_1: C?#85.1 R?#55.1 R?#67.1
NetC?#85_1: C?#85.1 R?#61.1  [a separate net that carries the same name]
NetC?#86_1: C?#86.1 U?#5.10(IND)
NetC?#87_1: C?#87.1 C?#89.1 L?#9.2
NetC?#87_1: C?#87.1 R?#65.1  [a separate net that carries the same name]
NetC?#88_1: C?#88.1 L?#9.1 R?#64.1
NetC?#88_1: C?#88.1 L?#10.1 R?#68.1  [a separate net that carries the same name]
NetC?#89_1: C?#89.1 C?#90.1 L?#10.2
NetC?#90_1: C?#90.1 R?#69.1
NetR?#16_1: R?#69.1 ; port HP_RXN0
NetR?#17_1: R?#45.1 ; port HP_RXN1
NetR?#18_1: R?#65.1 ; port HP_RXP0
NetR?#20_1: R?#42.1 ; port HP_RXP1
NetR?#43_1: R?#43.1 R?#48.1 ; port SIG, port CP
NetR?#46_1: R?#46.1 U?#5.15(OUTC)
NetR?#47_1: R?#47.1 T?#3.1
NetR?#51_1: R?#51.1 U?#5.3(NC)
NetR?#51_1: R?#51.1 U?#5.6(INB)  [a separate net that carries the same name]
NetR?#54_1: R?#54.1 U?#5.2(NC)
NetR?#54_1: R?#54.1 U?#5.7(INA)  [a separate net that carries the same name]
NetR?#55_1: R?#55.1 T?#3.3
NetR?#56_1: R?#56.1 U?#5.8(IBIAS)
NetR?#57_1: R?#57.1 U?#5.5(EN_AB)
NetR?#61_1: R?#61.1 U?#5.12(OUTD)
NetR?#62_1: R?#62.1 U?#5.11(ENB_CD) ; port MFIO coming from CG5317
NetR?#63_1: R?#63.1 R?#64.1 R?#66.1
NetR?#66_1: R?#66.1 R?#67.1 R?#68.1

Not connected (* = marked no-connect by the designer): T?#2 2 3 6 7; T?#3 5; U?#5 1(OUTA) 4(OUTB) 13(NC)* 14(NC)* 17(NC)* 19(NC)*

### Notes on the sheet
- Internal Line Driver
- Internal Line Driver has 0dB gain
- output homeplug comm signal
- CP has selector to connect with Ex. line driver or internal driver
- External Line Driver
- External Line Driver has 15dB gain
- Labels drawn without touching a wire or pin: GND

### Library data of the parts
?#1 ?#2 L?#5-L?#10 = Inductor_SMT: ComponentLink1Description: New link
C?#63-C?#90 = CAP_SMT: ComponentLink1Description: New link
R?#40-R?#69 = RES_SMT: ComponentLink1Description: New link; ComponentLink1URL: *
T?#1 = Transformer 4 pins: ComponentLink1Description: New link
T?#2 = Transformer 8 pin: ComponentLink1Description: New link
T?#3 = Transformer 6 pin: ComponentLink1Description: New link
U?#5 = IS31CG1110: Buffers & Line Drivers High-performance MIMO/SISO dual port differential line driver designed to work in broadband PLC system; ComponentLink1Description: New link

## Sheet Memory.SchDoc
size A; SheetNumber: 4; SheetTotal: 4

## Sheet Power_Supply.SchDoc
size D; SheetNumber: 5; SheetTotal: 8
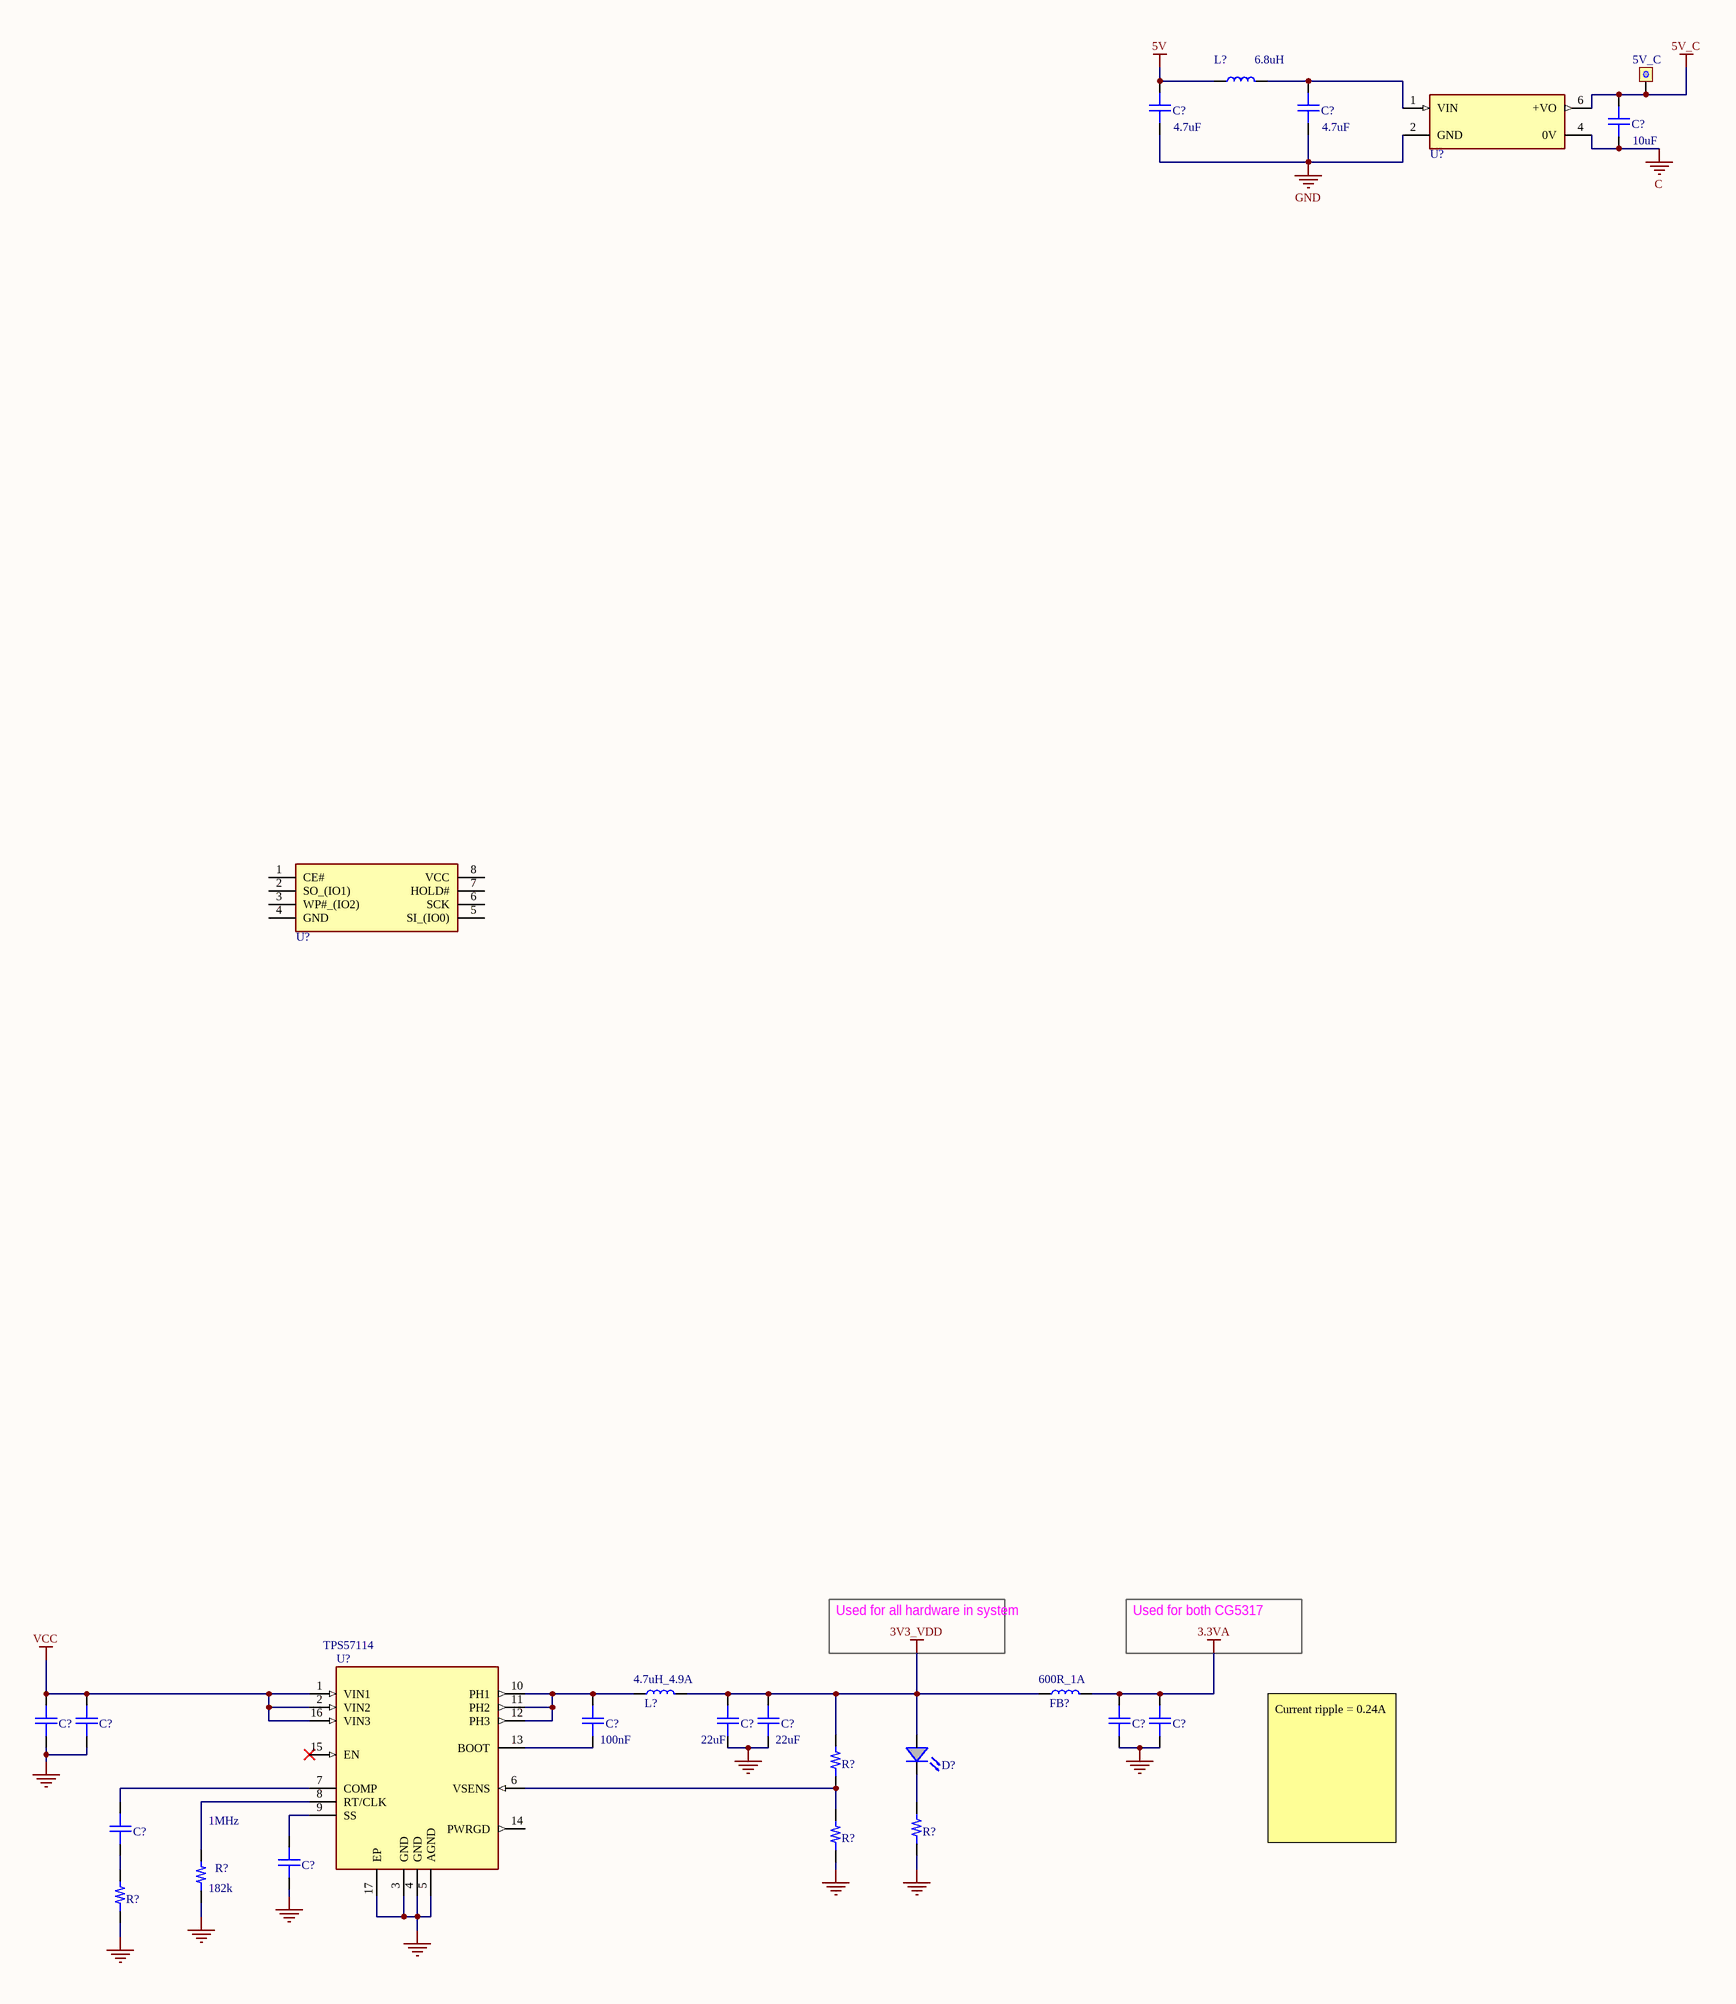
[diagram p3: Power_Supply.SchDoc]

### Parts
(Parts that share a designator on the sheet are numbered #1, #2 ... from top to bottom, then left to right.)
5V_C  Test Point  [Test Point]  (value not drawn)
C?#91  value 4.7uF  [C0402]  (hidden comment: Capacitor)
C?#92  value 4.7uF  [C0402]  (hidden comment: Capacitor)
C?#93  value 10uF  [C0402]  (hidden comment: Capacitor)
C?#94  Capacitor  [C0402]  (value not drawn)
C?#95  Capacitor  [C0402]  (value not drawn)
C?#96  100nF  [C0402]
C?#97  22uF  [C0402]
C?#98  22uF  [C0402]
C?#99  Capacitor  [C0402]  (value not drawn)
C?#100  Capacitor  [C0402]  (value not drawn)
C?#101  Capacitor  [C0402]  (value not drawn)
C?#102  Capacitor  [C0402]  (value not drawn)
D?#3  LED  [LED_0603]  (value not drawn)
FB?  600R_1A  [L_0805]
L?#11  value 6.8uH  [L_0805]  (hidden comment: Inductor)
L?#12  4.7uH_4.9A  [L_0805]
R?#70  Resistor  [R0402]  (value not drawn)
R?#71  Resistor  [R0402]  (value not drawn)
R?#72  Resistor  [R0402]  (value not drawn)
R?#73  182k  [R0402]
R?#74  Resistor  [R0402]  (value not drawn)
U?#6  B0505LS-1WR3  [CONV_B0505LS-1WR3 (SIP,19.7x6mm)]  (value not drawn)
U?#7  Flash Memory  [SOIC-8]  (value not drawn)
U?#8  TPS57114  [WQFN-16]

### Nets
3.3VA: C?#99.1 C?#100.1 FB?.2
3V3_VDD: C?#97.1 C?#98.1 D?#3.A FB?.1 L?#12.2 R?#70.1  [project net 3V3_CG]
5V: C?#91.1 L?#11.1
5V_C: 5V_C.0 C?#93.1 U?#6.6(+VO)
C: C?#93.1 U?#6.4(0V)
GND: C?#91.1 C?#92.1 C?#94.1 C?#95.1 C?#97.1 C?#98.1 C?#99.1 C?#100.1 C?#102.1 R?#71.1 R?#72.1 R?#73.1 R?#74.1 U?#6.2(GND) U?#8.3(GND) U?#8.4(GND) U?#8.5(AGND) U?#8.17(EP)
VCC: C?#94.1 C?#95.1 U?#8.1(VIN1) U?#8.2(VIN2) U?#8.16(VIN3)
NetC?#92_1: C?#92.1 L?#11.2 U?#6.1(VIN)
NetC?#96_1: C?#96.1 U?#8.13(BOOT)
NetC?#96_1: C?#96.1 L?#12.1 U?#8.10(PH1) U?#8.11(PH2) U?#8.12(PH3)  [a separate net that carries the same name]
NetC?#101_1: C?#101.1 R?#74.1
NetC?#101_1: C?#101.1 U?#8.7(COMP)  [a separate net that carries the same name]
NetC?#102_1: C?#102.1 U?#8.9(SS)
NetD?#3_C: D?#3.C(K) R?#71.1
NetR?#70_1: R?#70.1 R?#72.1 U?#8.6(VSENS)
NetR?#73_1: R?#73.1 U?#8.8(RT/CLK)

Not connected (* = marked no-connect by the designer): U?#7 1(CE#) 2(SO_(IO1)) 3(WP#_(IO2)) 4(GND) 5(SI_(IO0)) 6(SCK) 7(HOLD#) 8(VCC); U?#8 14(PWRGD) 15(EN)*

### Notes on the sheet
- Used for all hardware in system
- Used for both CG5317
- (near R?#73) 1MHz
- Current ripple = 0.24A

### Library data of the parts
C?#91-C?#102 = CAP_SMT: ComponentLink1Description: New link
FB? L?#11 L?#12 = Inductor_SMT: ComponentLink1Description: New link
R?#70-R?#74 = RES_SMT: ComponentLink1Description: New link; ComponentLink1URL: *
U?#6 = B0505LS-1WR3: Isolated Module DC DC Converter 1 Output 5V 200mA 4.5V - 5.5V Input; ComponentLink1Description: New link; ComponentLink1URL: *; value: *
U?#7 = IS25LP032D: as U?#4 on sheet PLC; ComponentLink1Description: New link; value: *
U?#8 = TPS57114: Buck Switching Regulator IC Positive Adjustable 0.8V 1 Output 4A 16-WFQFN Exposed Pad; ComponentLink1Description: New link
D?#3 = LED: ComponentLink1Description: New link

## Sheet Screen_Interface.SchDoc
size C; SheetNumber: 6; SheetTotal: 8
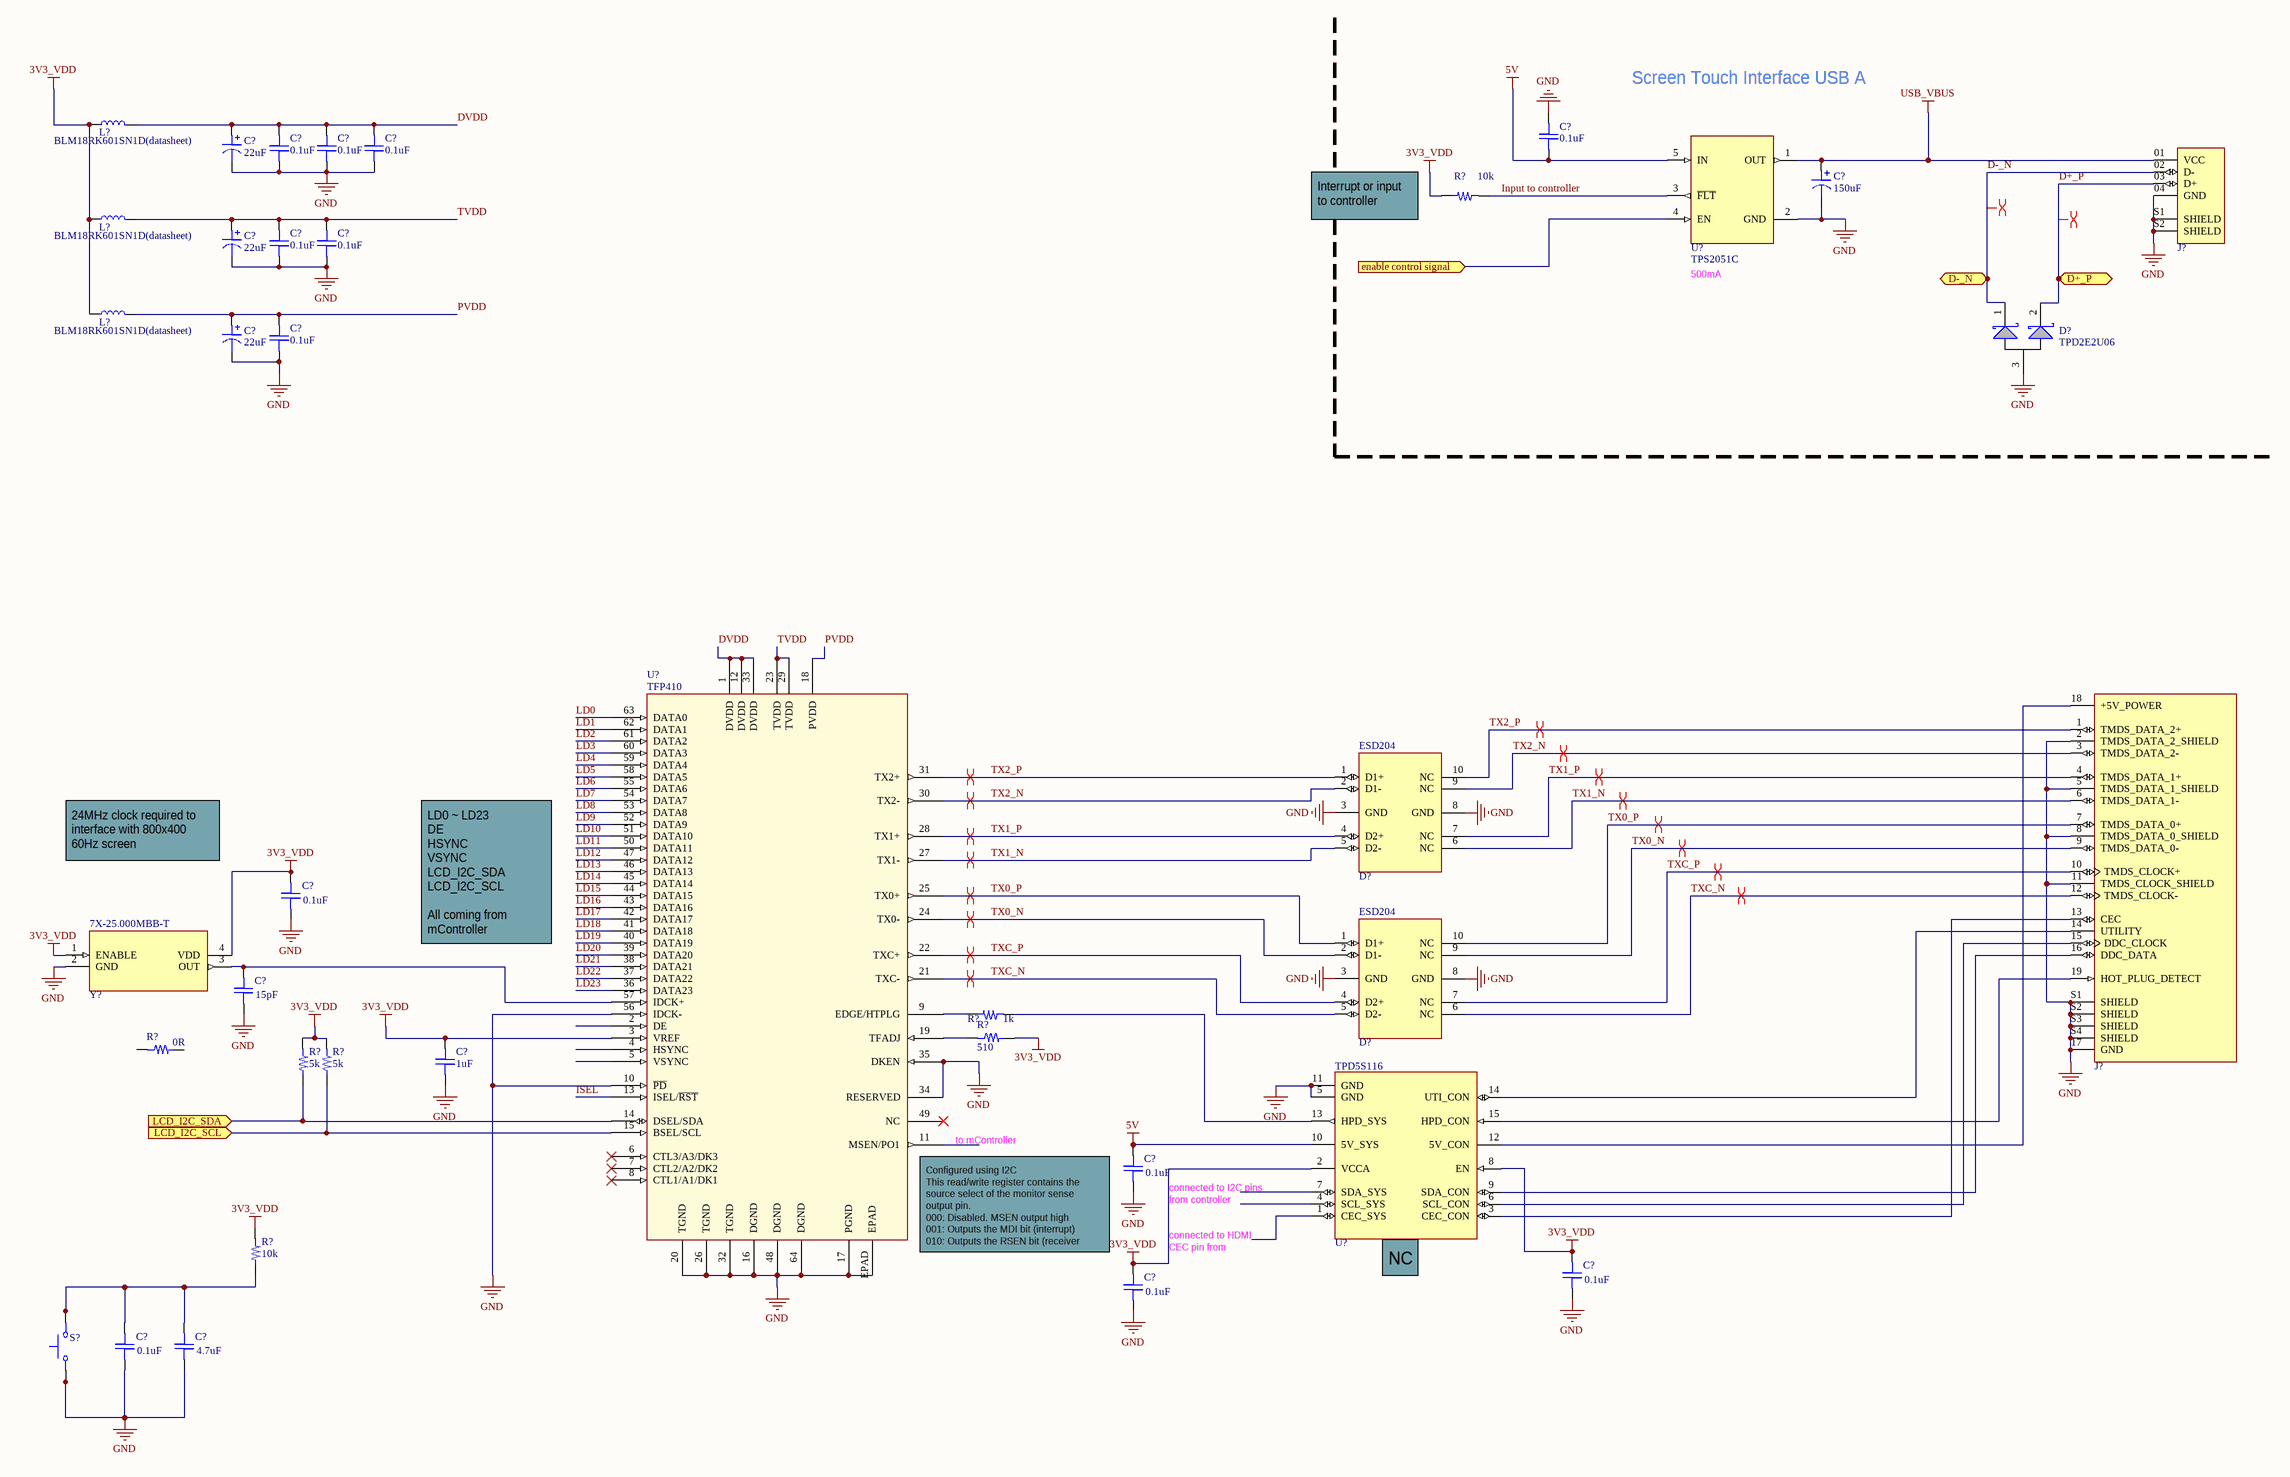
[diagram p4: Screen_Interface.SchDoc]

### Parts
(Parts that share a designator on the sheet are numbered #1, #2 ... from top to bottom, then left to right.)
C?#103  0.1uF  [C0402]
C?#104  value 22uF  [C_CASE-D-7343]  (hidden comment: Polarized Capacitor)
C?#105  0.1uF  [C0402]
C?#106  0.1uF  [C0402]
C?#107  0.1uF  [C0402]
C?#108  value 150uF  [C_CASE-D-7343]  (hidden comment: Polarized Capacitor)
C?#109  value 22uF  [C_CASE-D-7343]  (hidden comment: Polarized Capacitor)
C?#110  0.1uF  [C0402]
C?#111  0.1uF  [C0402]
C?#112  value 22uF  [C_CASE-D-7343]  (hidden comment: Polarized Capacitor)
C?#113  0.1uF  [C0402]
C?#114  value 0.1uF  [C0402]  (hidden comment: Capacitor)
C?#115  value 15pF  [C0402]  (hidden comment: Capacitor)
C?#116  1uF  [C0402]
C?#117  value 0.1uF  [C0402]  (hidden comment: Capacitor)
C?#118  value 0.1uF  [C0402]  (hidden comment: Capacitor)
C?#119  value 0.1uF  [C0402]  (hidden comment: Capacitor)
C?#120  value 0.1uF  [C0402]  (hidden comment: Capacitor)
C?#121  value 4.7uF  [C0402]  (hidden comment: Capacitor)
D?#4  value TPD2E2U06  [SOT-23-3]  (hidden comment: ESD Protection)
D?#5  value ESD204  [USON-10 (ESD204)]  (hidden comment: ESD Protection)
D?#6  value ESD204  [USON-10 (ESD204)]  (hidden comment: ESD Protection)
J?#1  USB Type A  [USB_TypeA_2.0]  (value not drawn)
J?#2  HDMI Type A  [HDMI TypeA SMD]  (value not drawn)
L?#13  value BLM18RK601SN1D(datasheet)  [L_0805]  (hidden comment: or we can use MMZ1608B102CTA00)
L?#14  value BLM18RK601SN1D(datasheet)  [L_0805]  (hidden comment: or we can use MMZ1608B102CTA00)
L?#15  value BLM18RK601SN1D(datasheet)  [L_0805]  (hidden comment: or we can use MMZ1608B102CTA00)
R?#75  value 10k  [R0402]  (hidden comment: Resistor)
R?#76  value 1k  [R0402]  (hidden comment: Resistor)
R?#77  value 5k  [R0402]  (hidden comment: Resistor)
R?#78  value 5k  [R0402]  (hidden comment: Resistor)
R?#79  value 510  [R0402]  (hidden comment: Resistor)
R?#80  value 0R  [R0402]  (hidden comment: Resistor)
R?#81  value 10k  [R0402]  (hidden comment: Resistor)
S?#2  Push Button 4 pin  [Push_Button(6x6mm)]  (value not drawn)
U?#9  value TPS2051C  [SOT-23-5]  (hidden comment: Current Limiting Power Switch)
U?#10  value TPD5S116  [DSBGA-15 (TPD5S116)]  (hidden comment: HDMI companion chip)
U?#11  value TFP410  [TFP410 (HTQFP-64)]
Y?#2  value 7X-25.000MBB-T  [7X-25.000MBB-T]  (hidden comment: Oscillator)

### Ports
D+_P (bidir), D-_N (bidir), enable control signal (in), LCD_I2C_SCL (in), LCD_I2C_SDA (in)

### Nets
3V3_VDD: C?#114.1 C?#116.1 C?#118.1 C?#119.1 L?#13.1 L?#14.1 L?#15.1 R?#75.1 R?#77.1 R?#78.1 R?#79.1 R?#81.1 U?#10.2(VCCA) U?#10.8(EN) U?#11.3(VREF) Y?#2.1(ENABLE) Y?#2.4(VDD)  [project net 3V3_CG]
5V: C?#103.1 C?#117.1 U?#9.5(IN) U?#10.10(5V_SYS)
GND: C?#103.1 C?#104.1 C?#105.1 C?#106.1 C?#107.1 C?#108.1 C?#109.1 C?#110.1 C?#111.1 C?#112.1 C?#113.1 C?#114.1 C?#115.1 C?#116.1 C?#117.1 C?#118.1 C?#119.1 C?#120.1 C?#121.1 D?#4.3(A) D?#5.3(GND) D?#5.8(GND) D?#6.3(GND) D?#6.8(GND) J?#1.04(GND) J?#1.S1(SHIELD) J?#1.S2(SHIELD) J?#2.2(TMDS_DATA_2_SHIELD) J?#2.5(TMDS_DATA_1_SHIELD) J?#2.8(TMDS_DATA_0_SHIELD) J?#2.11(TMDS_CLOCK_SHIELD) J?#2.17(GND) J?#2.S1(SHIELD) J?#2.S2(SHIELD) J?#2.S3(SHIELD) J?#2.S4(SHIELD) S?#2.1 S?#2.2 U?#9.2(GND) U?#10.5(GND) U?#10.11(GND) U?#11.10(~{PD}) U?#11.16(DGND) U?#11.17(PGND) U?#11.20(TGND) U?#11.26(TGND) U?#11.32(TGND) U?#11.34(RESERVED) U?#11.35(DKEN) U?#11.48(DGND) U?#11.56(IDCK-) U?#11.64(DGND) U?#11.EPAD Y?#2.2(GND)
USB_VBUS: C?#108.1 J?#1.01(VCC) U?#9.1(OUT)
D+_P: D?#4.2(K2) J?#1.03(D+) ; port D+_P
D-_N: D?#4.1(K1) J?#1.02(D-) ; port D-_N
DVDD: C?#104.1 C?#105.1 C?#106.1 C?#107.1 L?#13.2 U?#11.1(DVDD) U?#11.12(DVDD) U?#11.33(DVDD)
Input to controller: R?#75.1 U?#9.3(~{FLT})
ISEL: U?#11.13(ISEL/~{RST})
LD0: U?#11.63(DATA0)
LD1: U?#11.62(DATA1)
LD2: U?#11.61(DATA2)
LD3: U?#11.60(DATA3)
LD4: U?#11.59(DATA4)
LD5: U?#11.58(DATA5)
LD6: U?#11.55(DATA6)
LD7: U?#11.54(DATA7)
LD8: U?#11.53(DATA8)
LD9: U?#11.52(DATA9)
LD10: U?#11.51(DATA10)
LD11: U?#11.50(DATA11)
LD12: U?#11.47(DATA12)
LD13: U?#11.46(DATA13)
LD14: U?#11.45(DATA14)
LD15: U?#11.44(DATA15)
LD16: U?#11.43(DATA16)
LD17: U?#11.42(DATA17)
LD18: U?#11.41(DATA18)
LD19: U?#11.40(DATA19)
LD20: U?#11.39(DATA20)
LD21: U?#11.38(DATA21)
LD22: U?#11.37(DATA22)
LD23: U?#11.36(DATA23)
PVDD: C?#112.1 C?#113.1 L?#15.2 U?#11.18(PVDD)
TVDD: C?#109.1 C?#110.1 C?#111.1 L?#14.2 U?#11.23(TVDD) U?#11.29(TVDD)
TX0_N: D?#6.2(D1-) D?#6.9(NC) J?#2.9(TMDS_DATA_0-) U?#11.24(TX0-)
TX0_P: D?#6.1(D1+) D?#6.10(NC) J?#2.7(TMDS_DATA_0+) U?#11.25(TX0+)
TX1_N: D?#5.5(D2-) D?#5.6(NC) J?#2.6(TMDS_DATA_1-) U?#11.27(TX1-)
TX1_P: D?#5.4(D2+) D?#5.7(NC) J?#2.4(TMDS_DATA_1+) U?#11.28(TX1+)
TX2_N: D?#5.2(D1-) D?#5.9(NC) J?#2.3(TMDS_DATA_2-) U?#11.30(TX2-)
TX2_P: D?#5.1(D1+) D?#5.10(NC) J?#2.1(TMDS_DATA_2+) U?#11.31(TX2+)
TXC_N: D?#6.5(D2-) D?#6.6(NC) J?#2.12(TMDS_CLOCK-) U?#11.21(TXC-)
TXC_P: D?#6.4(D2+) D?#6.7(NC) J?#2.10(TMDS_CLOCK+) U?#11.22(TXC+)
NetC?#115_1: C?#115.1 U?#11.57(IDCK+) Y?#2.3(OUT)
NetC?#120_1: C?#120.1 C?#121.1 R?#81.1 S?#2.3 S?#2.4
NetJ?#2_13: J?#2.13(CEC) U?#10.3(CEC_CON)
NetJ?#2_14: J?#2.14(UTILITY) U?#10.14(UTI_CON)
NetJ?#2_15: J?#2.15(DDC_CLOCK) U?#10.6(SCL_CON)
NetJ?#2_16: J?#2.16(DDC_DATA) U?#10.9(SDA_CON)
NetJ?#2_18: J?#2.18(+5V_POWER) U?#10.12(5V_CON)
NetJ?#2_19: J?#2.19(HOT_PLUG_DETECT) U?#10.15(HPD_CON)
NetR?#76_1: R?#76.1 U?#10.13(HPD_SYS)
NetR?#76_1: R?#76.1 U?#11.9(EDGE/HTPLG)  [a separate net that carries the same name]
NetR?#77_1: R?#77.1 U?#11.14(DSEL/SDA) ; port LCD_I2C_SDA
NetR?#78_1: R?#78.1 U?#11.15(BSEL/SCL) ; port LCD_I2C_SCL
NetR?#79_1: R?#79.1 U?#11.19(TFADJ)
NetU?#9_4: U?#9.4(EN) ; port enable control signal

Not connected (* = marked no-connect by the designer): R?#80 1; U?#10 1(CEC_SYS) 4(SCL_SYS) 7(SDA_SYS); U?#11 2(DE) 4(HSYNC) 5(VSYNC) 6(CTL3/A3/DK3)* 7(CTL2/A2/DK2)* 8(CTL1/A1/DK1)* 11(MSEN/PO1) 49(NC)*

### Layout directives
differential pair; differential pair class USB_D: D+_P, D-_N
differential pair; differential pair class HDMI_Diff: TX0_N, TX0_P, TX1_N, TX1_P, TX2_N, TX2_P, TXC_N, TXC_P

### Notes on the sheet
- Screen Touch Interface USB A
- (near R?#75) Interrupt or input to controller
- 500mA max
- 24MHz clock required to interface with 800x400 60Hz screen
- LD0 ~ LD23
  DE
  HSYNC
  VSYNC
  LCD_I2C_SDA
  LCD_I2C_SCL
  All coming from mController
- to mController
- (near U?#11) Configured using I2C
  This read/write register contains the source select of the monitor sense output pin.
  000: Disabled. MSEN output high
  001: Outputs the MDI bit (interrupt)
  010: Outputs the RSEN bit (receiver detect)
  011: Outputs the HTPLG bit (hot plug detect)
- (near C?#119) connected to HDMI CEC pin from controller
- (near C?#117) connected to I2C pins from controller
- (near U?#10) NC

### Library data of the parts
C?#103 C?#105-C?#107 C?#110 C?#111 C?#113-C?#121 = CAP_SMT: ComponentLink1Description: New link
C?#104 C?#108 C?#109 C?#112 = C_Polarized: ComponentLink1Description: New link
D?#4 = TPD2E2U06: Dual 1.5-pF, 5.5-V, ±25-kV ESD protection diode with 5.5-A 8/20-uS surge rating for USB 2.0; ComponentLink1Description: New link; ComponentLink1URL: *
D?#5 D?#6 = ESD204: ESD / Quad 0.55-pF, ±3.6-V, ±30-kV ESD protection diode with 5.5A surge rating for USB & HDMI; ComponentLink1Description: New link
J?#1 = USB_TypeA_2.0: ComponentLink1Description: New link
J?#2 = HDMI_TypeA: HDMI, Input Output Connectors, Receptacle, Type A, Right Angle, Surface Mount, 19 Positions.; ComponentLink1Description: New link
L?#13-L?#15 = Inductor_SMT: ComponentLink1Description: New link
R?#75-R?#81 = RES_SMT: ComponentLink1Description: New link; ComponentLink1URL: *
S?#2 = Push_Button: Push Button SMD(6x6mm) 4 pin; ComponentLink1Description: New link
U?#9 = TPS2051C: Current Limiting Switch 0.5A loading, 4.5-5.5V, 97mΩ USB power switch, active-high, output discharge, reverse blocking; ComponentLink1Description: New link; ComponentLink1URL: *
U?#10 = TPD5S116: HDMI companion chip with 5-V load switch, level shifter, and ESD clamp; ComponentLink1Description: New link
U?#11 = TFP410: HDMI Transmitter - 165-MHz TMDS DVI transmitter/serializer & Panelbus; ComponentLink1Description: New link
Y?#2 = 7X-25.000MBB-T: Standard Clock Oscillators 25.000MHz 3.3V50ppm(-10 +70C); ComponentLink1Description: New link

## Sheet CAN_Interface.SchDoc
size A; SheetNumber: 7; SheetTotal: 8
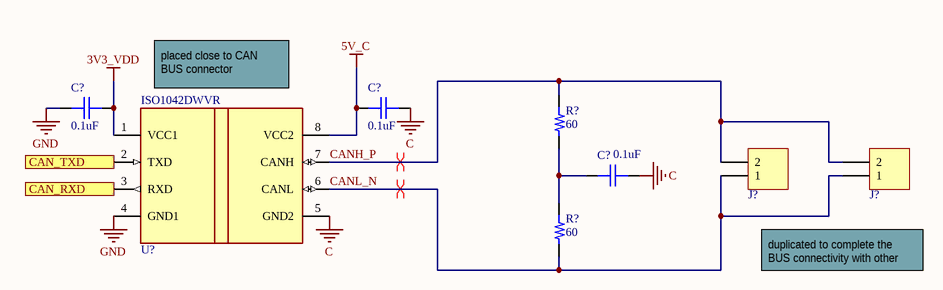
[diagram p5: CAN_Interface.SchDoc]

### Parts
(Parts that share a designator on the sheet are numbered #1, #2 ... from top to bottom, then left to right.)
C?#122  value 0.1uF  [C0402]  (hidden comment: Capacitor)
C?#123  value 0.1uF  [C0402]  (hidden comment: Capacitor)
C?#124  value 0.1uF  [C0402]  (hidden comment: Capacitor)
J?#3  2 Position-5.08mm Pitch Terminal Block  [Terminal_Block_2 Pin_5.08mm]  (value not drawn)
J?#4  2 Position-5.08mm Pitch Terminal Block  [Terminal_Block_2 Pin_5.08mm]  (value not drawn)
R?#82  value 60  [R0402]  (hidden comment: Resistor)
R?#83  value 60  [R0402]  (hidden comment: Resistor)
U?#12  value ISO1042DWVR  [ISO1042DWVR]  (hidden comment: CAN Transceiver)

### Ports
CAN_RXD (out), CAN_TXD (in)

### Nets
3V3_VDD: C?#122.1 U?#12.1(VCC1)  [project net 3V3_CG]
5V_C: C?#123.1 U?#12.8(VCC2)
C: C?#123.1 C?#124.1 U?#12.5(GND2)
GND: C?#122.1 U?#12.4(GND1)
CANH_P: J?#3.2 J?#4.2 R?#82.1 U?#12.7(CANH)
CANL_N: J?#3.1 J?#4.1 R?#83.1 U?#12.6(CANL)
NetC?#124_1: C?#124.1 R?#82.1 R?#83.1
NetU?#12_2: U?#12.2(TXD) ; port CAN_TXD
NetU?#12_3: U?#12.3(RXD) ; port CAN_RXD

### Layout directives
differential pair; differential pair class CAN: CANH_P, CANL_N

### Notes on the sheet
- placed close to CAN BUS connector
- duplicated to complete the BUS connectivity with other nodes

### Library data of the parts
C?#122-C?#124 = CAP_SMT: ComponentLink1Description: New link
J?#3 J?#4 = Terminal Block 2P: ComponentLink1Description: New link; ComponentLink1URL: *
R?#82 R?#83 = RES_SMT: ComponentLink1Description: New link; ComponentLink1URL: *
U?#12 = ISO1042DWVR: CAN Interface IC Isolated CAN transceiver with 70-V bus fault protection & flexible data rate 8-SOIC -40 to 125; ComponentLink1Description: New link